# Altium schematic sheet BOWIE_FINGERS.SchDoc
size A; SheetNumber: 3; SheetTotal: 8
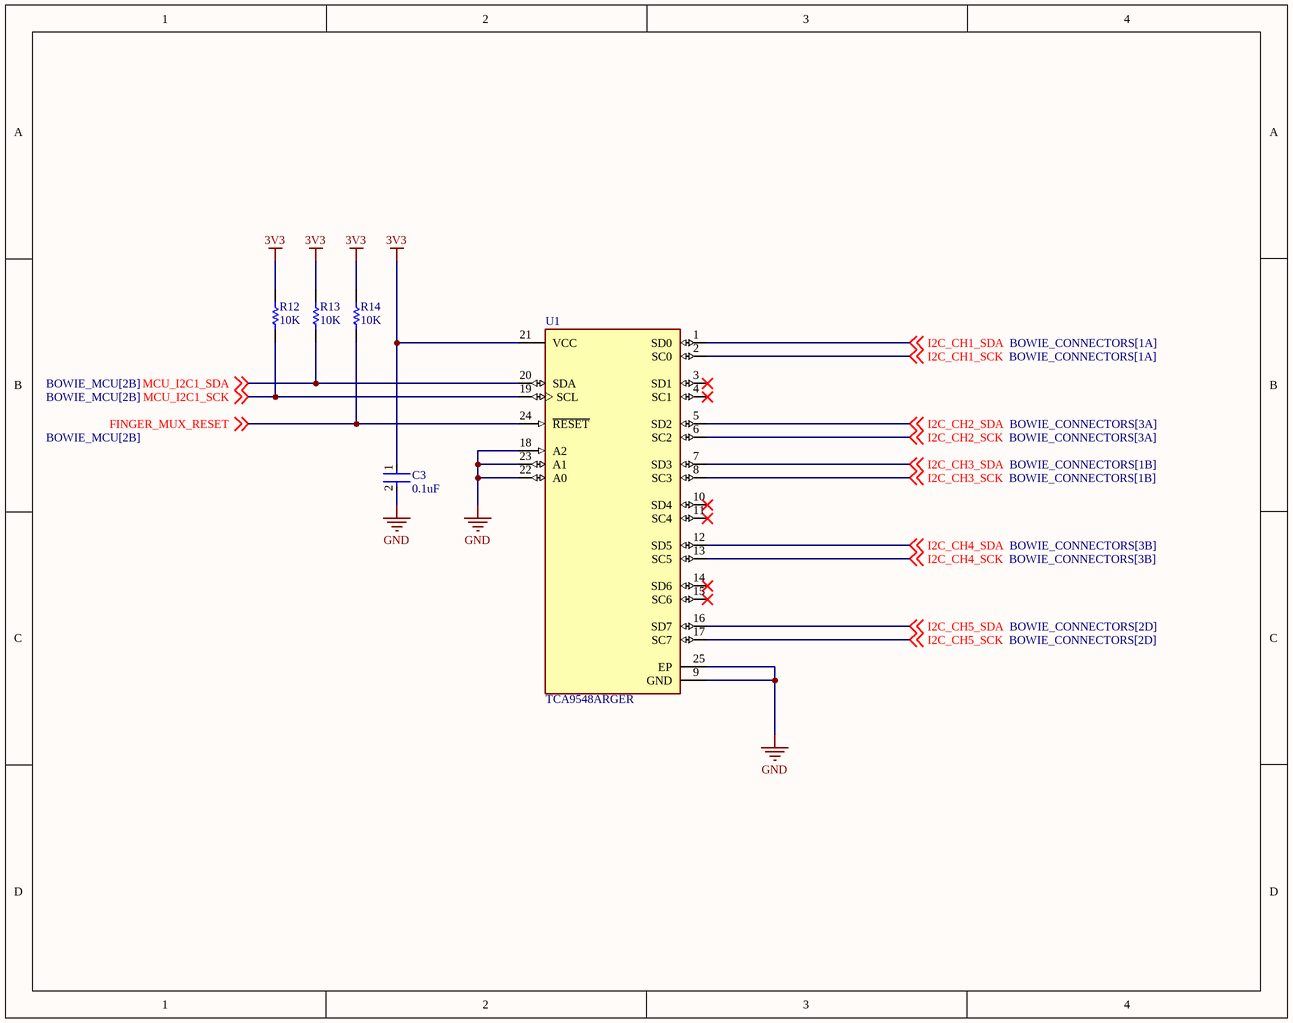
[diagram p0: BOWIE_FINGERS.SchDoc]

## Parts
C3  0.1uF  [FP-GRM15-MFG]
R12  10K  [RESC1005X40X25NL05T05]
R13  10K  [RESC1005X40X25NL05T05]
R14  10K  [RESC1005X40X25ML05T10]
U1  TCA9548ARGER  [FP-RGE0024C-MFG]

## Nets
3V3: C3.1 R12.2 R13.2 R14.2 U1.21(VCC)
GND: C3.2 U1.9(GND) U1.18(A2) U1.22(A0) U1.23(A1) U1.25(EP)
FINGER_MUX_RESET: R14.1 U1.24(~{RESET}) ; off-sheet FINGER_MUX_RESET
I2C_CH1_SCK: U1.2(SC0) ; off-sheet I2C_CH1_SCK
I2C_CH1_SDA: U1.1(SD0) ; off-sheet I2C_CH1_SDA
I2C_CH2_SCK: U1.6(SC2) ; off-sheet I2C_CH2_SCK
I2C_CH2_SDA: U1.5(SD2) ; off-sheet I2C_CH2_SDA
I2C_CH3_SCK: U1.8(SC3) ; off-sheet I2C_CH3_SCK
I2C_CH3_SDA: U1.7(SD3) ; off-sheet I2C_CH3_SDA
I2C_CH4_SCK: U1.13(SC5) ; off-sheet I2C_CH4_SCK
I2C_CH4_SDA: U1.12(SD5) ; off-sheet I2C_CH4_SDA
I2C_CH5_SCK: U1.17(SC7) ; off-sheet I2C_CH5_SCK
I2C_CH5_SDA: U1.16(SD7) ; off-sheet I2C_CH5_SDA
MCU_I2C1_SCK: R12.1 U1.19(SCL) ; off-sheet MCU_I2C1_SCK
MCU_I2C1_SDA: R13.1 U1.20(SDA) ; off-sheet MCU_I2C1_SDA

Not connected (* = marked no-connect by the designer): U1 3(SD1)* 4(SC1)* 10(SD4)* 11(SC4)* 14(SD6)* 15(SC6)*

## Library data of the parts
C3 = CMP-2100-03641-2: CAP CER 0.1UF 16V X7R 0402; Manufacturer Part Number: GRM155R71C104KA88D; Manufacturer: Murata; Standoff Height: 0mm; Tolerance: 10%; Voltage Rating: 16Vdc; Material: Ceramic; Capacitance: 0.10μF; Value: 0.10μF; RoHS: TRUE; Temperature Characteristic: X7R; Octopart: https://octopart.com/grm155r71c104ka88d-murata-196880; Digikey Description: CAP CER 0.1UF 16V X7R 0402; Device Class L3: Ceramic Capacitors; Height: 0.55mm; ComponentLink2Description: Datasheet; Temperature Range Low: -55°C; Ipc Land Pattern Name: CAPC10050X219; ComponentLink2URL: https://search.murata.co.jp/Ceramy/image/img/A01X/G101/ENG/GRM155R71H471KA01-01A.pdf; Device Class L1: Passive Components; Lead Free: yes; Category: Cap; Package: GRM15; Temperature: -55°C to +125°C; Device Class L2: Capacitors; Temperature Range High: +125°C; Mouser Description: 0402 0.1 uF 16V ±10 % Tolerance X7R SMT Multilayer Ceramic Capacitor
R12 R13 = CMP-1011-00510-4: Chip Resistor, 1 KOhm, +/- 1%, 100 mW, -55 to 155 degC, 0402 (1005 Metric), RoHS, Tape and Reel; PartNumber: ERJ-2RKF1001X; Manufacturer: Basic Passives; Voltage Rating: 50 V; Case\/Package: 0402; Resistance: 1 KOhm; Power Rating: 100 mW; DatasheetVersion: 04/2015; Radiation Hardening: No; Pins: 2; Height: 0.35 mm; RoHSCompliant: true; Case Code (Imperial): 0402; ComponentLink2Description: Datasheet; ComponentLink1Description: Manufacturer URL; PackageReference: 0402; Mount: Surface Mount; Package Quantity: 10000; Tolerance: 1%; ComponentLink1URL: http://www.panasonic.com/; PackageDescription: 2-Pin Surface Mount Device, Body 1 x 0.5 mm; Mounting Technology: Surface Mount; Case Code (Metric): 1005; ComponentLink2URL: http://industrial.panasonic.com/cdbs/www-data/pdf/RDA0000/AOA0000C86.pdf; REACH SVHC: Yes; Packaging: Tape and Reel; Max Operating Temperature: 155 degC; Min Operating Temperature: -55 degC; Width: 0.5 mm; Length: 1 mm
R14 = CMP-2002-03043-1: Part Number: CRCW040210K0FKEDHP; Manufacturer: Vishay Dale
U1 = CMP-04892-000041-1: IC I2C SW 8CH W/RESET 24VQFN; Independent Circuits: 1; Supply Type: Single; Max Supply Voltage: 5.5V; On-State Resistance: 70R; Max Supply Current: 80uA; Min Supply Voltage: 1.65V; Propagation Delay: 1ns; Mount: Surface Mount; Case/Package: VQFN; Number of Pins: 24; REACH SVHC: No SVHC; RoHS Compliant: Yes; Lead Free: Lead Free; Radiation Hardening: No; Weight: 0.001926oz; Min Operating Temperature: -40°C; Package Quantity: 3000; Packaging: Tape and Reel; Max Operating Temperature: 85°C